# Altium schematic sheet CUK_3Ph_sig_conditioner.SchDoc
size A
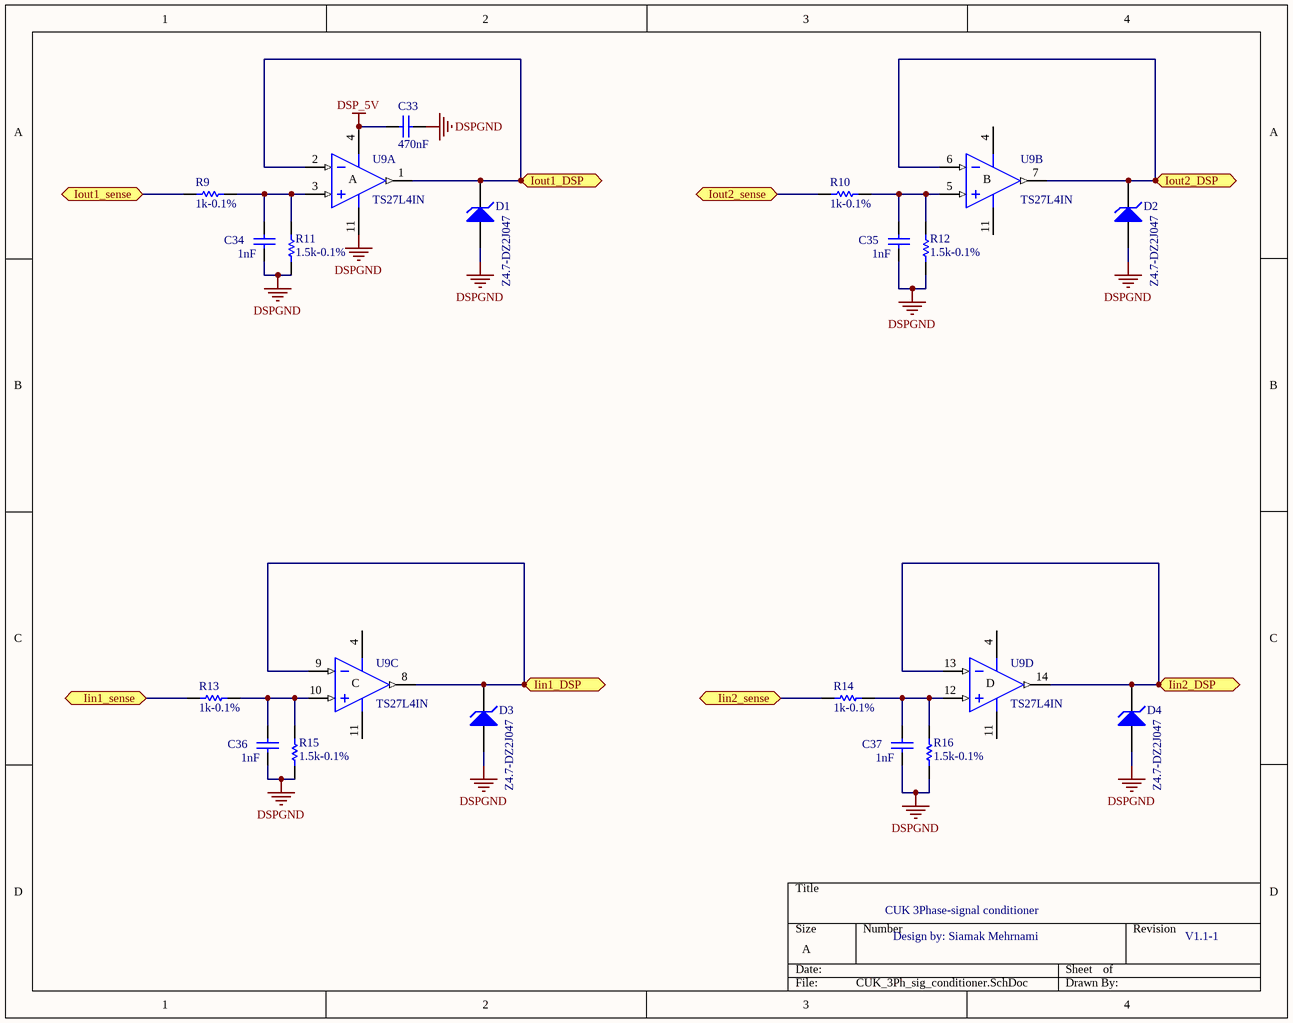
[diagram p0: CUK_3Ph_sig_conditioner.SchDoc]

## Parts
C33  value 470nF  [Capacitor 0805]  (hidden comment: Cap)
C34  value 1nF  [Capacitor 0805]  (hidden comment: Cap)
C35  value 1nF  [Capacitor 0805]  (hidden comment: Cap)
C36  value 1nF  [Capacitor 0805]  (hidden comment: Cap)
C37  value 1nF  [Capacitor 0805]  (hidden comment: Cap)
D1  Z4.7-DZ2J047  [Zener DZ2J047]
D2  Z4.7-DZ2J047  [Zener DZ2J047]
D3  Z4.7-DZ2J047  [Zener DZ2J047]
D4  Z4.7-DZ2J047  [Zener DZ2J047]
R9  value 1k-0.1%  [0805 RES]  (hidden comment: Res1)
R10  value 1k-0.1%  [0805 RES]  (hidden comment: Res1)
R11  value 1.5k-0.1%  [0805 RES]  (hidden comment: Res1)
R12  value 1.5k-0.1%  [0805 RES]  (hidden comment: Res1)
R13  value 1k-0.1%  [0805 RES]  (hidden comment: Res1)
R14  value 1k-0.1%  [0805 RES]  (hidden comment: Res1)
R15  value 1.5k-0.1%  [0805 RES]  (hidden comment: Res1)
R16  value 1.5k-0.1%  [0805 RES]  (hidden comment: Res1)
U9  TS27L4IN  [DIP14]  (parts A,B,C,D of 4)

## Ports
Iin1_DSP, Iin1_sense, Iin2_DSP, Iin2_sense, Iout1_DSP, Iout1_sense (bidir), Iout2_DSP, Iout2_sense (bidir)

## Nets
DSP_5V: C33.2 U9.4(V+)
DSPGND: C33.1 C34.1 C35.1 C36.1 C37.1 D1.1(A) D2.1(A) D3.1(A) D4.1(A) R11.1 R12.1 R15.1 R16.1 U9.11(V-)
Iin1_DSP: D3.2(K) U9.8(OUT) U9.9(IN-) ; port Iin1_DSP
Iin1_sense: R13.2 ; port Iin1_sense
Iin2_DSP: D4.2(K) U9.13(IN-) U9.14(OUT) ; port Iin2_DSP
Iin2_sense: R14.2 ; port Iin2_sense
Iout1_DSP: D1.2(K) U9.1(OUT) U9.2(IN-) ; port Iout1_DSP
Iout1_sense: R9.2 ; port Iout1_sense
Iout2_DSP: D2.2(K) U9.6(IN-) U9.7(OUT) ; port Iout2_DSP
Iout2_sense: R10.2 ; port Iout2_sense
NetC34_2: C34.2 R9.1 R11.2 U9.3(IN+)
NetC35_2: C35.2 R10.1 R12.2 U9.5(IN+)
NetC36_2: C36.2 R13.1 R15.2 U9.10(IN+)
NetC37_2: C37.2 R14.1 R16.2 U9.12(IN+)

## Notes on the sheet
- CUK 3Phase-signal conditioner
- Design by: Siamak Mehrnami
- V1.1-1
- (in symbol TS27L4AMD, part A) A
- (in symbol TS27L4AMD, part B) B
- (in symbol TS27L4AMD, part C) C
- (in symbol TS27L4AMD, part D) D

## Library data of the parts
C33-C37 = Cap: Capacitor; Published: 8-Jun-2000; LatestRevisionDate: 17-Jul-2002; LatestRevisionNote: Re-released for DXP Platform.; PackageReference: RAD-0.3; Publisher: Altium Limited
D1-D4 = D Zener: Zener Diode; Published: 8-Jun-2000; LatestRevisionDate: 17-Jul-2002; LatestRevisionNote: Re-released for DXP Platform.; PackageReference: DIODE-0.7; Publisher: Altium Limited
R9-R16 = Res1: Resistor; Published: 8-Jun-2000; LatestRevisionDate: 17-Jul-2002; LatestRevisionNote: Re-released for DXP Platform.; PackageReference: AXIAL-0.3; Publisher: Altium Limited
U9 = TS27L4AMD: Very Low-Power CMOS Quad Operational Amplifier; Published: 24-Aug-2001; LatestRevisionDate: 13-Apr-2006; LatestRevisionNote: IPC-7351 Footprint Added.; DatasheetVersion: Nov-1998; PackageVersion: Sep-1998; PackageReference: SO14; Publisher: Altium Limited; PackageDescription: 14-Pin Small Outline Integrated Circuit 1.27 mm Pitch; Code_IPC: SOIC127P600-14; ComponentLink1Description: Manufacturer Link; ComponentLink1URL: http://www.st.com/; ComponentLink2Description: Datasheet; ComponentLink2URL: http://www.st.com/stonline/products/literature/ds/2305/ts27l4.pdf